# Altium schematic sheet HD-JYQ70-YD03-MAIN.SchDoc
size B
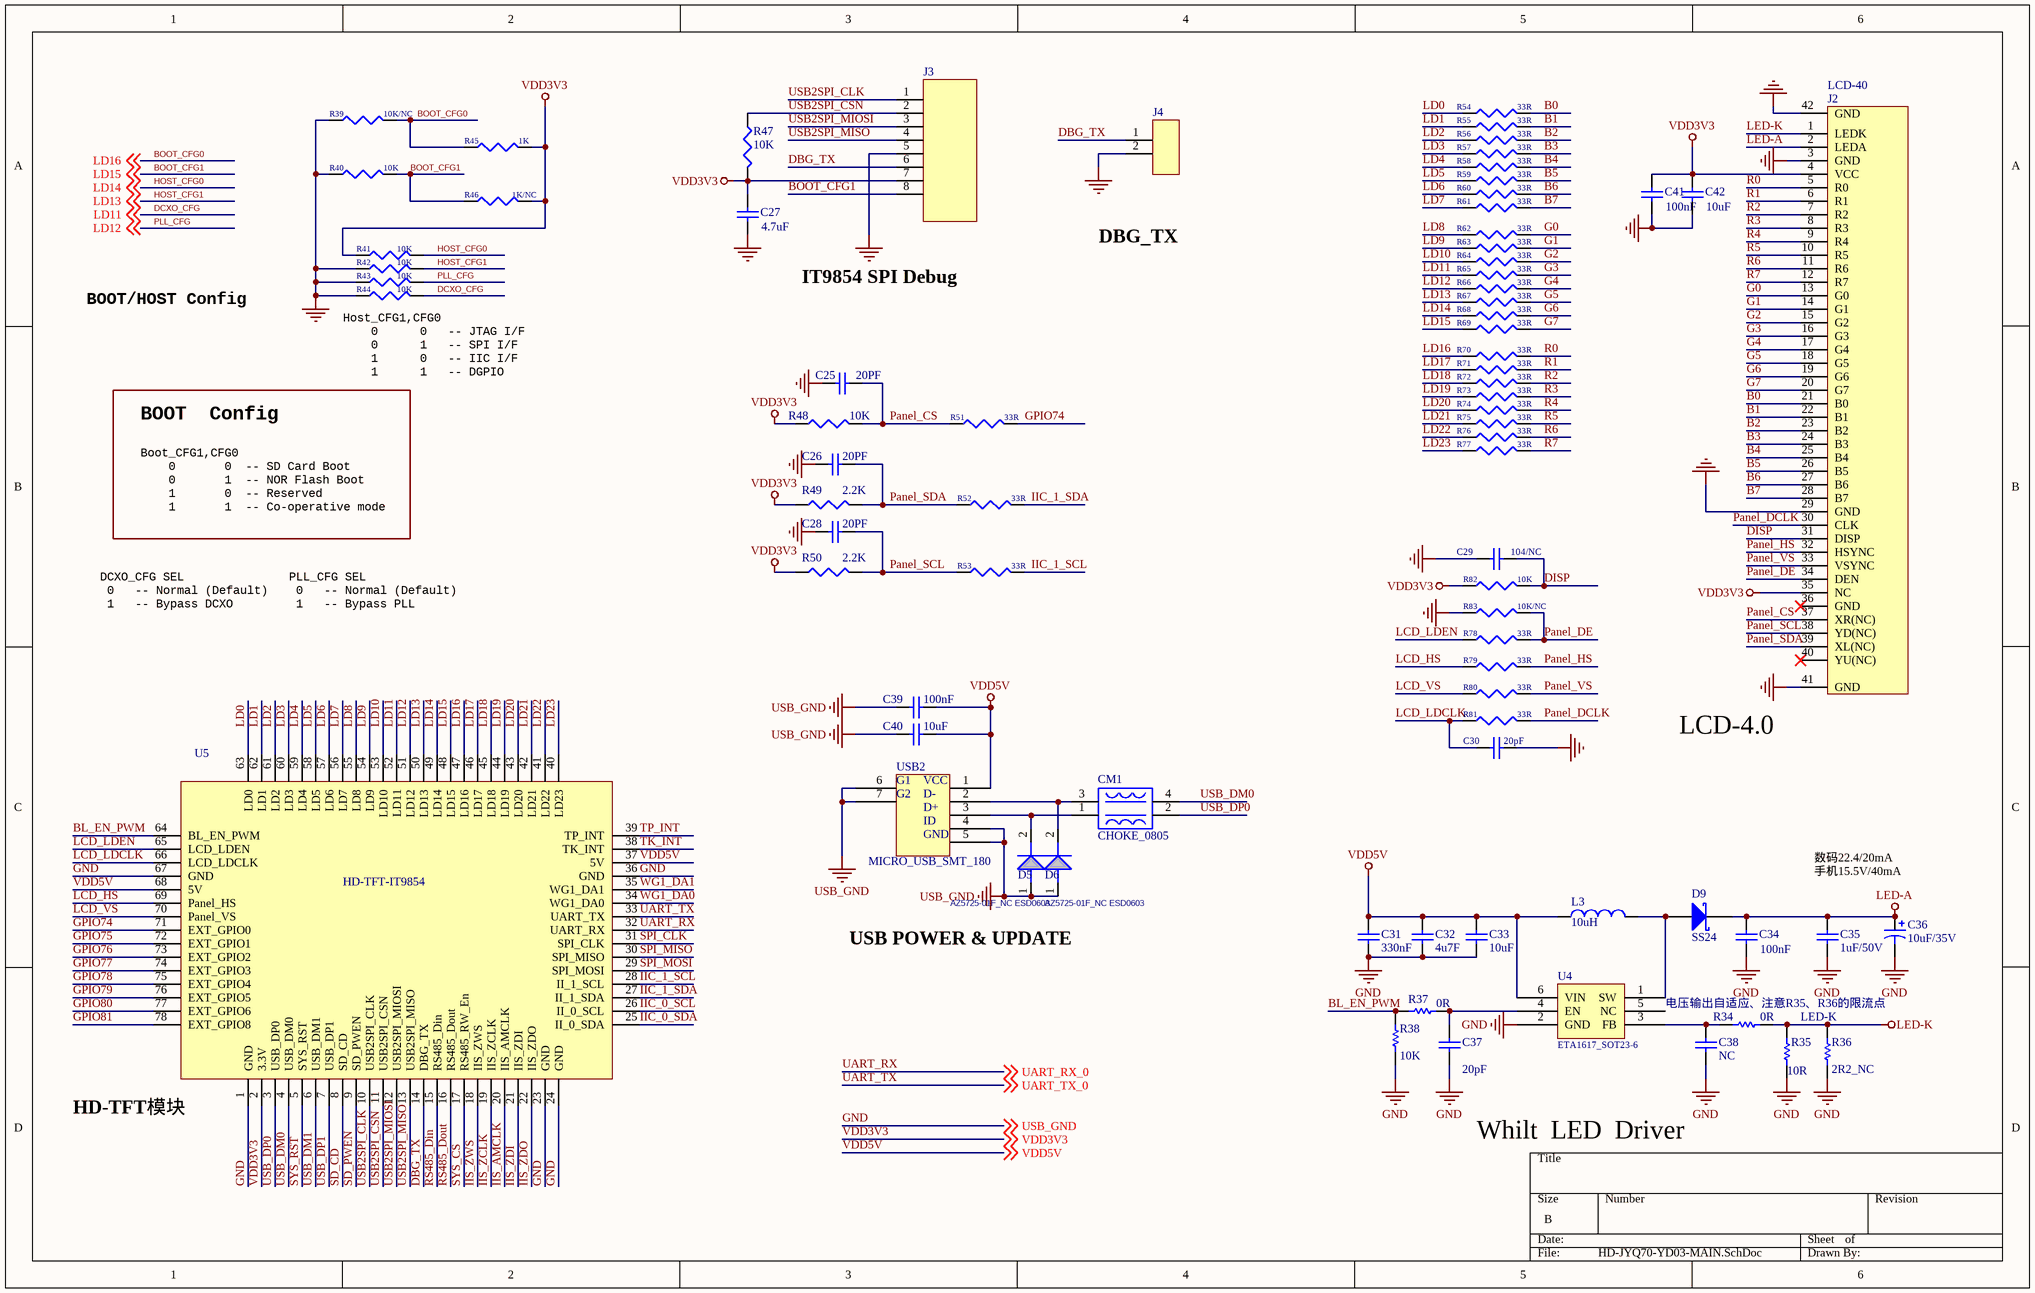
[diagram p0: HD-JYQ70-YD03-MAIN.SchDoc]

## Parts
C25  value 20PF  [X-0603C]  (hidden comment: Cap)
C26  value 20PF  [X-0603C]  (hidden comment: Cap)
C27  value 4.7uF  [X-0603C]  (hidden comment: Cap)
C28  value 20PF  [X-0603C]  (hidden comment: Cap)
C29  value 104/NC  [X-0603C]  (hidden comment: Cap Semi)
C30  value 20pF  [X-0603C]  (hidden comment: Cap Semi)
C31  330nF  [X-0603C]
C32  4u7F  [X-0603C]
C33  10uF  [X-0603C]
C34  value 100nF  [X-0603C]
C35  1uF/50V  [X-0603C]
C36  10uF/35V  [H-1206C]
C37  value 20pF  [X-0603C]  (hidden comment: Cap)
C38  NC  [X-0603C]
C39  value 100nF  [X-0603C]  (hidden comment: Cap Semi)
C40  value 10uF  [X-0603C]  (hidden comment: Cap Semi)
C41  value 100nF  [X-0603C]  (hidden comment: Cap Semi)
C42  value 10uF  [X-0603C]  (hidden comment: Cap Semi)
CM1  CHOKE_0805  [CHOKE_0805]
D5  AZ5725-01F_NC ESD0603  [D0603]
D6  AZ5725-01F_NC ESD0603  [D0603]
D9  SS24  [H-DIODE_SMA]
J2  LCD-40  [FPC-05-40P-R]
J3  CON15_1  [HEADER8X1$2F$2.54]  (value not drawn)
J4  CON2  [HEADER2X1$2F$2.54]  (value not drawn)
L3  value 10uH  [ZAD-6045]  (hidden comment: Inductor)
R34  value 0R  [X-0603R]  (hidden comment: Res1)
R35  value 10R  [X-0603R]  (hidden comment: Res1)
R36  value 2R2_NC  [X-0603R]  (hidden comment: Res1)
R37  value 0R  [X-0603R]  (hidden comment: Res1)
R38  value 10K  [X-0603R]  (hidden comment: Res1)
R39  value 10K/NC  [X-0603R]  (hidden comment: 10K)
R40  10K  [X-0603R]
R41  10K  [X-0603R]
R42  10K  [X-0603R]
R43  10K  [X-0603R]
R44  10K  [X-0603R]
R45  value 1K  [X-0603R]  (hidden comment: 10K)
R46  value 1K/NC  [X-0603R]  (hidden comment: 10K)
R47  10K  [X-0603R]
R48  10K  [X-0603R]
R49  value 2.2K  [X-0603R]  (hidden comment: 10K)
R50  value 2.2K  [X-0603R]  (hidden comment: 10K)
R51  value 33R  [X-0603R]  (hidden comment: 10K)
R52  value 33R  [X-0603R]  (hidden comment: 10K)
R53  value 33R  [X-0603R]  (hidden comment: 10K)
R54  value 33R  [X-0603R]  (hidden comment: 10K)
R55  value 33R  [X-0603R]  (hidden comment: 10K)
R56  value 33R  [X-0603R]  (hidden comment: 10K)
R57  value 33R  [X-0603R]  (hidden comment: 10K)
R58  value 33R  [X-0603R]  (hidden comment: 10K)
R59  value 33R  [X-0603R]  (hidden comment: 10K)
R60  value 33R  [X-0603R]  (hidden comment: 10K)
R61  value 33R  [X-0603R]  (hidden comment: 10K)
R62  value 33R  [X-0603R]  (hidden comment: 10K)
R63  value 33R  [X-0603R]  (hidden comment: 10K)
R64  value 33R  [X-0603R]  (hidden comment: 10K)
R65  value 33R  [X-0603R]  (hidden comment: 10K)
R66  value 33R  [X-0603R]  (hidden comment: 10K)
R67  value 33R  [X-0603R]  (hidden comment: 10K)
R68  value 33R  [X-0603R]  (hidden comment: 10K)
R69  value 33R  [X-0603R]  (hidden comment: 10K)
R70  value 33R  [X-0603R]  (hidden comment: 10K)
R71  value 33R  [X-0603R]  (hidden comment: 10K)
R72  value 33R  [X-0603R]  (hidden comment: 10K)
R73  value 33R  [X-0603R]  (hidden comment: 10K)
R74  value 33R  [X-0603R]  (hidden comment: 10K)
R75  value 33R  [X-0603R]  (hidden comment: 10K)
R76  value 33R  [X-0603R]  (hidden comment: 10K)
R77  value 33R  [X-0603R]  (hidden comment: 10K)
R78  value 33R  [X-0603R]  (hidden comment: 10K)
R79  value 33R  [X-0603R]  (hidden comment: 10K)
R80  value 33R  [X-0603R]  (hidden comment: 10K)
R81  value 33R  [X-0603R]  (hidden comment: 10K)
R82  10K  [X-0603R]
R83  value 10K/NC  [X-0603R]  (hidden comment: 10K)
U4  ETA1617_SOT23-6  [TSOT26-6P$2F$0.95$2F$3X3]
U5  HD-TFT-IT9854  [HD-TFT-IT9854]
USB2  MICRO_USB_SMT_180  [MICRO_USB_SMT_180]

## Nets
GND: C25.1 C26.1 C27.1 C28.1 C29.1 C30.1 C31.1 C32.1 C33.1 C34.1 C35.1 C36.2 C37.1 C38.1 C39.1 C40.1 C41.1 C42.1 D5.1(ANODE) D6.1(ANODE) J2.3(GND) J2.29(GND) J2.41(GND) J2.42(GND) J3.5 J4.2 R35.2 R36.2 R38.1 R39.1 R40.1 R42.1 R43.1 R44.1 R83.1 U4.2(GND) U5.1(GND) U5.23(GND) U5.24(GND) U5.36(GND) U5.67(GND) USB2.4(D-) USB2.5(D-) USB2.6(D-) USB2.7(D-) ; off-sheet USB_GND  [also labelled USB_GND]
LED-A: C34.2 C35.2 C36.1 D9.2(K) J2.2(LEDA)
LED-K: J2.1(LEDK) R34.1 R35.1 R36.1
VDD3V3: C27.2 C41.2 C42.2 J2.4(VCC) J2.35(NC) J3.7 R41.1 R45.2 R46.2 R47.2 R48.1 R49.1 R50.1 R82.1 U5.2(3.3V) ; off-sheet VDD3V3
VDD5V: C31.2 C32.2 C33.2 C39.2 C40.2 L3.1 U4.6(VIN) U5.37(5V) U5.68(5V) USB2.1(VCC) ; off-sheet VDD5V
B0: J2.21(B0) R54.2
B1: J2.22(B1) R55.2
B2: J2.23(B2) R56.2
B3: J2.24(B3) R57.2
B4: J2.25(B4) R58.2
B5: J2.26(B5) R59.2
B6: J2.27(B6) R60.2
B7: J2.28(B7) R61.2
BL_EN_PWM: R37.1 R38.2 U5.64(BL_EN_PWM)
BOOT_CFG0: R39.2 R45.1 R70.1 U5.47(LD16) ; off-sheet LD16  [also labelled LD16]
BOOT_CFG1: J3.8 R40.2 R46.1 R69.1 U5.48(LD15) ; off-sheet LD15  [also labelled LD15]
DBG_TX: J3.6 J4.1 U5.14(DBG_TX)
DCXO_CFG: R44.2 R65.1 U5.52(LD11) ; off-sheet LD11  [also labelled LD11]
DISP: C29.2 J2.31(DISP) R82.2
G0: J2.13(G0) R62.2
G1: J2.14(G1) R63.2
G2: J2.15(G2) R64.2
G3: J2.16(G3) R65.2
G4: J2.17(G4) R66.2
G5: J2.18(G5) R67.2
G6: J2.19(G6) R68.2
G7: J2.20(G7) R69.2
GPIO74: R51.2 U5.71(EXT_GPIO0)
GPIO75: U5.72(EXT_GPIO1)
GPIO76: U5.73(EXT_GPIO2)
GPIO77: U5.74(EXT_GPIO3)
GPIO78: U5.75(EXT_GPIO4)
GPIO79: U5.76(EXT_GPIO5)
GPIO80: U5.77(EXT_GPIO6)
GPIO81: U5.78(EXT_GPIO8)
HOST_CFG0: R41.2 R68.1 U5.49(LD14) ; off-sheet LD14  [also labelled LD14]
HOST_CFG1: R42.2 R67.1 U5.50(LD13) ; off-sheet LD13  [also labelled LD13]
IIC_0_SCL: U5.26(II_0_SCL)
IIC_0_SDA: U5.25(II_0_SDA)
IIC_1_SCL: R53.2 U5.28(II_1_SCL)
IIC_1_SDA: R52.2 U5.27(II_1_SDA)
IIS_AMCLK: U5.20(IIS_AMCLK)
IIS_ZCLK: U5.19(IIS_ZCLK)
IIS_ZDI: U5.21(IIS_ZDI)
IIS_ZDO: U5.22(IIS_ZDO)
IIS_ZWS: U5.18(IIS_ZWS)
LCD_HS: R79.1 U5.69(Panel_HS)
LCD_LDCLK: C30.2 R81.1 U5.66(LCD_LDCLK)
LCD_LDEN: R78.1 U5.65(LCD_LDEN)
LCD_VS: R80.1 U5.70(Panel_VS)
LD0: R54.1 U5.63(LD0)
LD1: R55.1 U5.62(LD1)
LD2: R56.1 U5.61(LD2)
LD3: R57.1 U5.60(LD3)
LD4: R58.1 U5.59(LD4)
LD5: R59.1 U5.58(LD5)
LD6: R60.1 U5.57(LD6)
LD7: R61.1 U5.56(LD7)
LD8: R62.1 U5.55(LD8)
LD9: R63.1 U5.54(LD9)
LD10: R64.1 U5.53(LD10)
LD12: R43.2 R66.1 U5.51(LD12) ; off-sheet LD12  [also labelled PLL_CFG]
LD17: R71.1 U5.46(LD17)
LD18: R72.1 U5.45(LD18)
LD19: R73.1 U5.44(LD19)
LD20: R74.1 U5.43(LD20)
LD21: R75.1 U5.42(LD21)
LD22: R76.1 U5.41(LD22)
LD23: R77.1 U5.40(LD23)
Panel_CS: C25.2 J2.37(XR(NC)) R48.2 R51.1
Panel_DCLK: J2.30(CLK) R81.2
Panel_DE: J2.34(DEN) R78.2 R83.2
Panel_HS: J2.32(HSYNC) R79.2
Panel_SCL: C28.2 J2.38(YD(NC)) R50.2 R53.1
Panel_SDA: C26.2 J2.39(XL(NC)) R49.2 R52.1
Panel_VS: J2.33(VSYNC) R80.2
R0: J2.5(R0) R70.2
R1: J2.6(R1) R71.2
R2: J2.7(R2) R72.2
R3: J2.8(R3) R73.2
R4: J2.9(R4) R74.2
R5: J2.10(R5) R75.2
R6: J2.11(R6) R76.2
R7: J2.12(R7) R77.2
RS485_Din: U5.15(RS485_Din)
RS485_Dout: U5.16(RS485_Dout)
SD_CD: U5.8(SD_CD)
SD_PWEN: U5.9(SD_PWEN)
SPI_CLK: U5.31(SPI_CLK)
SPI_MISO: U5.30(SPI_MISO)
SPI_MOSI: U5.29(SPI_MOSI)
SYS_CS: U5.17(RS485_RW_En)
SYS_RST: U5.5(SYS_RST)
TK_INT: U5.38(TK_INT)
TP_INT: U5.39(TP_INT)
UART_RX: U5.32(UART_RX) ; off-sheet UART_RX_0  [also labelled UART_RX_0]
UART_TX: U5.33(UART_TX) ; off-sheet UART_TX_0  [also labelled UART_TX_0]
USB2SPI_CLK: J3.1 U5.10(USB2SPI_CLK)
USB2SPI_CSN: J3.2 R47.1 U5.11(USB2SPI_CSN)
USB2SPI_MIOSI: J3.3 U5.12(USB2SPI_MIOSI)
USB2SPI_MISO: J3.4 U5.13(USB2SPI_MISO)
USB_DM0: CM1.4(KC) U5.4(USB_DM0)
USB_DM1: U5.6(USB_DM1)
USB_DP0: CM1.2(KC) U5.3(USB_DP0)
USB_DP1: U5.7(USB_DP1)
WG1_DA0: U5.34(WG1_DA0)
WG1_DA1: U5.35(WG1_DA1)
NetC37_2: C37.2 R37.2 U4.4(EN)
NetC38_2: C38.2 R34.2 U4.3(FB)
NetCM1_1: CM1.1(KC) D5.2(CATHODE) USB2.3(D-)
NetCM1_3: CM1.3(KC) D6.2(CATHODE) USB2.2(D-)
NetD9_1: D9.1(A) L3.2 U4.1(SW)

Not connected (* = marked no-connect by the designer): J2 36(GND)* 40(YU(NC))*; U4 5(NC)

## Notes on the sheet
- IT9854 SPI Debug
- DBG_TX
- BOOT/HOST Config
- BOOT  Config
- (near R44) Host_CFG1,CFG0
  0      0   -- JTAG I/F
  0      1   -- SPI I/F
  1      0   -- IIC I/F
  1      1   -- DGPIO
- Boot_CFG1,CFG0
  0       0  -- SD Card Boot
  0       1  -- NOR Flash Boot
  1       0  -- Reserved
  1       1  -- Co-operative mode
- DCXO_CFG SEL
  0   -- Normal (Default)
  1   -- Bypass DCXO
- PLL_CFG SEL
  0   -- Normal (Default)
  1   -- Bypass PLL
- LCD-4.0
- 数码22.4/20mA
  手机15.5V/40mA
- USB POWER & UPDATE
- (near R34) 电压输出自适应、注意R35、R36的限流点
- LED-K
- (near U5) HD-TFT模块
- Whilt  LED  Driver
- (in symbol USB) G1; G2; D+; ID; GND

## Library data of the parts
C25-C28 C34 C37 = Cap: Capacitor; Published: 8-Jun-2000; LatestRevisionDate: 17-Jul-2002; LatestRevisionNote: Re-released for DXP Platform.; PackageReference: RAD-0.3; Publisher: Altium Limited; PackageDescription: Radial Cap, Thru-Hole; 2 Leads; 0.3 in Pin Spacing
C29 C30 C39-C42 = Cap Semi: Capacitor (Semiconductor SIM Model); Published: 8-Jun-2000; LatestRevisionDate: 29-May-2009; LatestRevisionNote: IPC-7351 Footprint Added.; PackageReference: C1206; Publisher: Altium Limited; PackageDescription: Chip Capacitor
C31-C33 C35 C38 = Cap: Capacitor; Value: 100pF; Published: 8-Jun-2000; LatestRevisionDate: 17-Jul-2002; LatestRevisionNote: Re-released for DXP Platform.; PackageReference: RAD-0.3; Publisher: Altium Limited; PackageDescription: Radial Cap, Thru-Hole; 2 Leads; 0.3 in Pin Spacing
C36 = Cap Pol1: Polarized Capacitor (Radial); Value: 100pF; Published: 8-Jun-2000; LatestRevisionDate: 17-Jul-2002; LatestRevisionNote: Re-released for DXP Platform.; PackageReference: RB7.6-15; Publisher: Altium Limited; PackageDescription: Polarized Capacitor (Radial); 2 Leads
D5 D6 = DIODE_2
D9 = Diode 11DQ03: Schottky Rectifier; Published: 8-Jun-2000; LatestRevisionDate: 17-Jul-2002; LatestRevisionNote: Re-released for DXP Platform.; DatasheetVersion: Dec-1997; PackageReference: DO-204AL; Publisher: Altium Limited; PackageDescription: Diode, Axial; Body 5.2 x 2.7 mm (LxDia. max), Lead Dia. 0.86 mm (max); Code_JEDEC: DO-204-AL; ComponentLink1Description: Manufacturer Link; ComponentLink1URL: http://www.irf.com/; ComponentLink2Description: Datasheet; ComponentLink2URL: http://www.irf.com/product-info/datasheets/data/11dq03.pdf
J2 = CON42
L3 = Inductor: Code_IEC: 1005; Published: 8-Jun-2000; LatestRevisionDate: 29-May-2009; LatestRevisionNote: IPC-7351 Footprint Added.; PackageReference: 0402-A; Publisher: Altium Limited; PackageDescription: Chip Inductor; Code_JEITA: 0402
R34-R38 = Res1: Resistor; Published: 8-Jun-2000; LatestRevisionDate: 17-Jul-2002; LatestRevisionNote: Re-released for DXP Platform.; PackageReference: AXIAL-0.3; Publisher: Altium Limited; PackageDescription: Axial Device, Thru-Hole; 2 Leads; 0.3 in Pin Spacing
R39-R83 = Res3: Resistor; Published: 8-Jun-2000; LatestRevisionDate: 29-May-2009; LatestRevisionNote: IPC-7351 Footprint Added.; PackageReference: J1-0603; Publisher: Altium Limited; PackageDescription: Chip Resistor
  R40-R44 R47 R48 R82: Value: 10K
U4 = Component_1
USB2 = USB